# Altium project scanline.PrjPCB
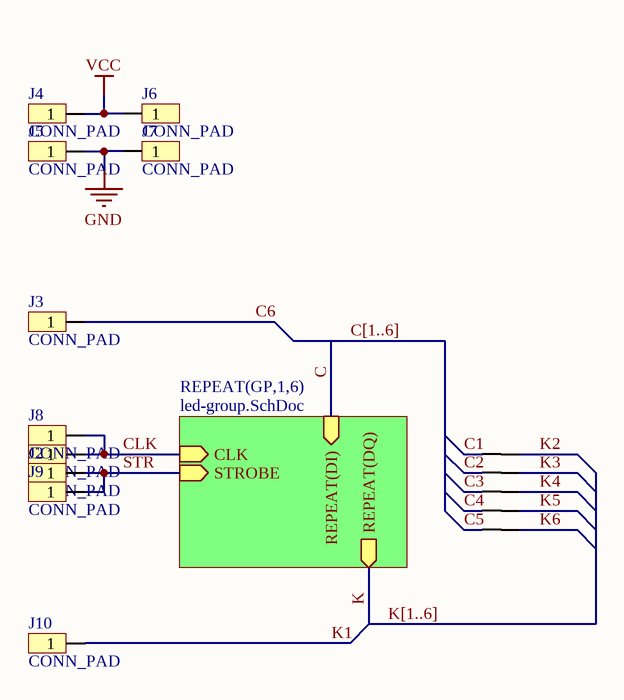
[diagram p0: scanline.SchDoc]
2 sheets, 129 parts. Net scope: hierarchical (ports join the sheet entries above them; power ports are global).
Board file: scanline.PcbDoc
Sheets:
  scanline.SchDoc
    GP1 = led-group.SchDoc
    GP2 = led-group.SchDoc
    GP3 = led-group.SchDoc
    GP4 = led-group.SchDoc
    GP5 = led-group.SchDoc
    GP6 = led-group.SchDoc

## Sheet scanline.SchDoc
size A

### Parts
J1  CONN_PAD
J2  CONN_PAD
J3  CONN_PAD
J4  CONN_PAD
J5  CONN_PAD
J6  CONN_PAD
J7  CONN_PAD
J8  CONN_PAD
J9  CONN_PAD
J10  CONN_PAD
T2  NETTIE  [NETTIE]  (value not drawn)  (net tie, no BOM)
T3  NETTIE  [NETTIE]  (value not drawn)  (net tie, no BOM)
T4  NETTIE  [NETTIE]  (value not drawn)  (net tie, no BOM)
T5  NETTIE  [NETTIE]  (value not drawn)  (net tie, no BOM)
T6  NETTIE  [NETTIE]  (value not drawn)  (net tie, no BOM)

### Sub-sheets
REPEAT(GP,1,6) = led-group.SchDoc: CLK (in), REPEAT(DI) (in), REPEAT(DQ) (out), STROBE (in)

### Nets
GND: J5.1 J7.1
VCC: J4.1 J6.1
C: sheet REPEAT(GP,1,6)/REPEAT(DI)
C1: T2.1
C2: T3.1
C3: T4.1
C4: T5.1
C5: T6.1
C6: J3.1
CLK: J1.1 J8.1 ; sheet REPEAT(GP,1,6)/CLK
K: sheet REPEAT(GP,1,6)/REPEAT(DQ)
K1: J10.1
K2: T2.2
K3: T3.2
K4: T4.2
K5: T5.2
K6: T6.2
STR: J2.1 J9.1 ; sheet REPEAT(GP,1,6)/STROBE

### Buses and harness runs
bus C[1..6]
bus K[1..6]

## Sheet led-group.SchDoc
size A
Used 6 times, as channels GP1, GP2, GP3, GP4, GP5, GP6. Parts and nets are listed once, with the designators drawn on the sheet.
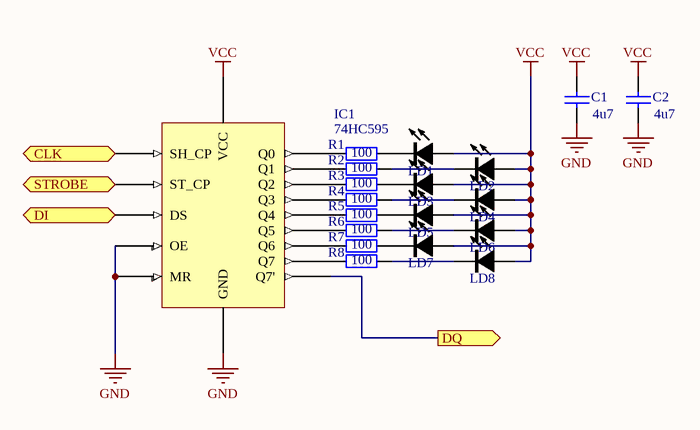
[diagram p1: led-group.SchDoc]

### Parts
C1  value 4u7  [6-0805_M]  (hidden comment: Cap)
C2  value 4u7  [6-0805_M]  (hidden comment: Cap)
IC1  74HC595  [TSSOP16]
LD1  UV-LED  [0805-LED]  (value not drawn)
LD2  UV-LED  [0805-LED]  (value not drawn)
LD3  UV-LED  [0805-LED]  (value not drawn)
LD4  UV-LED  [0805-LED]  (value not drawn)
LD5  UV-LED  [0805-LED]  (value not drawn)
LD6  UV-LED  [0805-LED]  (value not drawn)
LD7  UV-LED  [0805-LED]  (value not drawn)
LD8  UV-LED  [0805-LED]  (value not drawn)
R1  value 100  [6-0805_N]
R2  value 100  [6-0805_N]
R3  value 100  [6-0805_N]
R4  value 100  [6-0805_N]
R5  value 100  [6-0805_N]
R6  value 100  [6-0805_N]
R7  value 100  [6-0805_N]
R8  value 100  [6-0805_N]

### Ports
CLK (in), DI (in), DQ (out), STROBE (in)

### Nets
GND: C1.1 C2.1 IC1.8(GND) IC1.10(MR) IC1.13(OE)
VCC: C1.2 C2.2 IC1.16(VCC) LD1.A LD2.A LD3.A LD4.A LD5.A LD6.A LD7.A LD8.A
CLK: IC1.11(SH_CP) ; port CLK
DI: IC1.14(DS) ; port DI
DQ: IC1.9(Q7') ; port DQ
STROBE: IC1.12(ST_CP) ; port STROBE
NetIC1_1: IC1.1(Q1) R2.1
NetIC1_2: IC1.2(Q2) R3.1
NetIC1_3: IC1.3(Q3) R4.1
NetIC1_4: IC1.4(Q4) R5.1
NetIC1_5: IC1.5(Q5) R6.1
NetIC1_6: IC1.6(Q6) R7.1
NetIC1_7: IC1.7(Q7) R8.1
NetIC1_15: IC1.15(Q0) R1.1
NetLD1_K: LD1.K R1.2
NetLD2_K: LD2.K R2.2
NetLD3_K: LD3.K R3.2
NetLD4_K: LD4.K R4.2
NetLD5_K: LD5.K R5.2
NetLD6_K: LD6.K R6.2
NetLD7_K: LD7.K R7.2
NetLD8_K: LD8.K R8.2

### Channels
GP1: designators end in _GP1; ports CLK=CLK DI=C1 DQ=K1 STROBE=STR
GP2: designators end in _GP2; ports CLK=CLK DI=C2 DQ=K2 STROBE=STR
GP3: designators end in _GP3; ports CLK=CLK DI=C3 DQ=K3 STROBE=STR
GP4: designators end in _GP4; ports CLK=CLK DI=C4 DQ=K4 STROBE=STR
GP5: designators end in _GP5; ports CLK=CLK DI=C5 DQ=K5 STROBE=STR
GP6: designators end in _GP6; ports CLK=CLK DI=C6 DQ=K6 STROBE=STR

### Library data of the parts
C1 C2 = Cap: Capacitor
IC1 = Component_1: 74HC595 8-bit latched SIPO shift register
R1-R8 = Res2: Resistor

## Nets that join several sheets
GND: scanline (J5.1 J7.1), GP1 (5 pins), GP2 (5 pins), GP3 (5 pins), GP4 (5 pins), GP5 (5 pins), GP6 (5 pins)
VCC: scanline (J4.1 J6.1), GP1 (11 pins), GP2 (11 pins), GP3 (11 pins), GP4 (11 pins), GP5 (11 pins), GP6 (11 pins)
C1: scanline (T2.1), GP1 (IC1_GP1.14)
C2: scanline (T3.1), GP2 (IC1_GP2.14)
C3: scanline (T4.1), GP3 (IC1_GP3.14)
C4: scanline (T5.1), GP4 (IC1_GP4.14)
C5: scanline (T6.1), GP5 (IC1_GP5.14)
C6: scanline (J3.1), GP6 (IC1_GP6.14)
CLK: scanline (J1.1 J8.1), GP1 (IC1_GP1.11), GP2 (IC1_GP2.11), GP3 (IC1_GP3.11), GP4 (IC1_GP4.11), GP5 (IC1_GP5.11), GP6 (IC1_GP6.11)
K1: scanline (J10.1), GP1 (IC1_GP1.9)
K2: scanline (T2.2), GP2 (IC1_GP2.9)
K3: scanline (T3.2), GP3 (IC1_GP3.9)
K4: scanline (T4.2), GP4 (IC1_GP4.9)
K5: scanline (T5.2), GP5 (IC1_GP5.9)
K6: scanline (T6.2), GP6 (IC1_GP6.9)
STR: scanline (J2.1 J9.1), GP1 (IC1_GP1.12), GP2 (IC1_GP2.12), GP3 (IC1_GP3.12), GP4 (IC1_GP4.12), GP5 (IC1_GP5.12), GP6 (IC1_GP6.12)